# EasyEDA Pro project ProPrj_flex_ir_golf_2025-05-10.epro

# Schematic Schematic1
Board Name: Board1; Create Date: 2024-04-06; Page Name: P1; Project Name: flex_ir_golf; Schematic Name: Schematic1; Update Date: 2025-05-02; Company: EasyEDA.com; Drawn: EasyEDA; Page Size: A4; Part Number: JLCPCB-002; Reviewed: EasyEDA; Version: V0.1
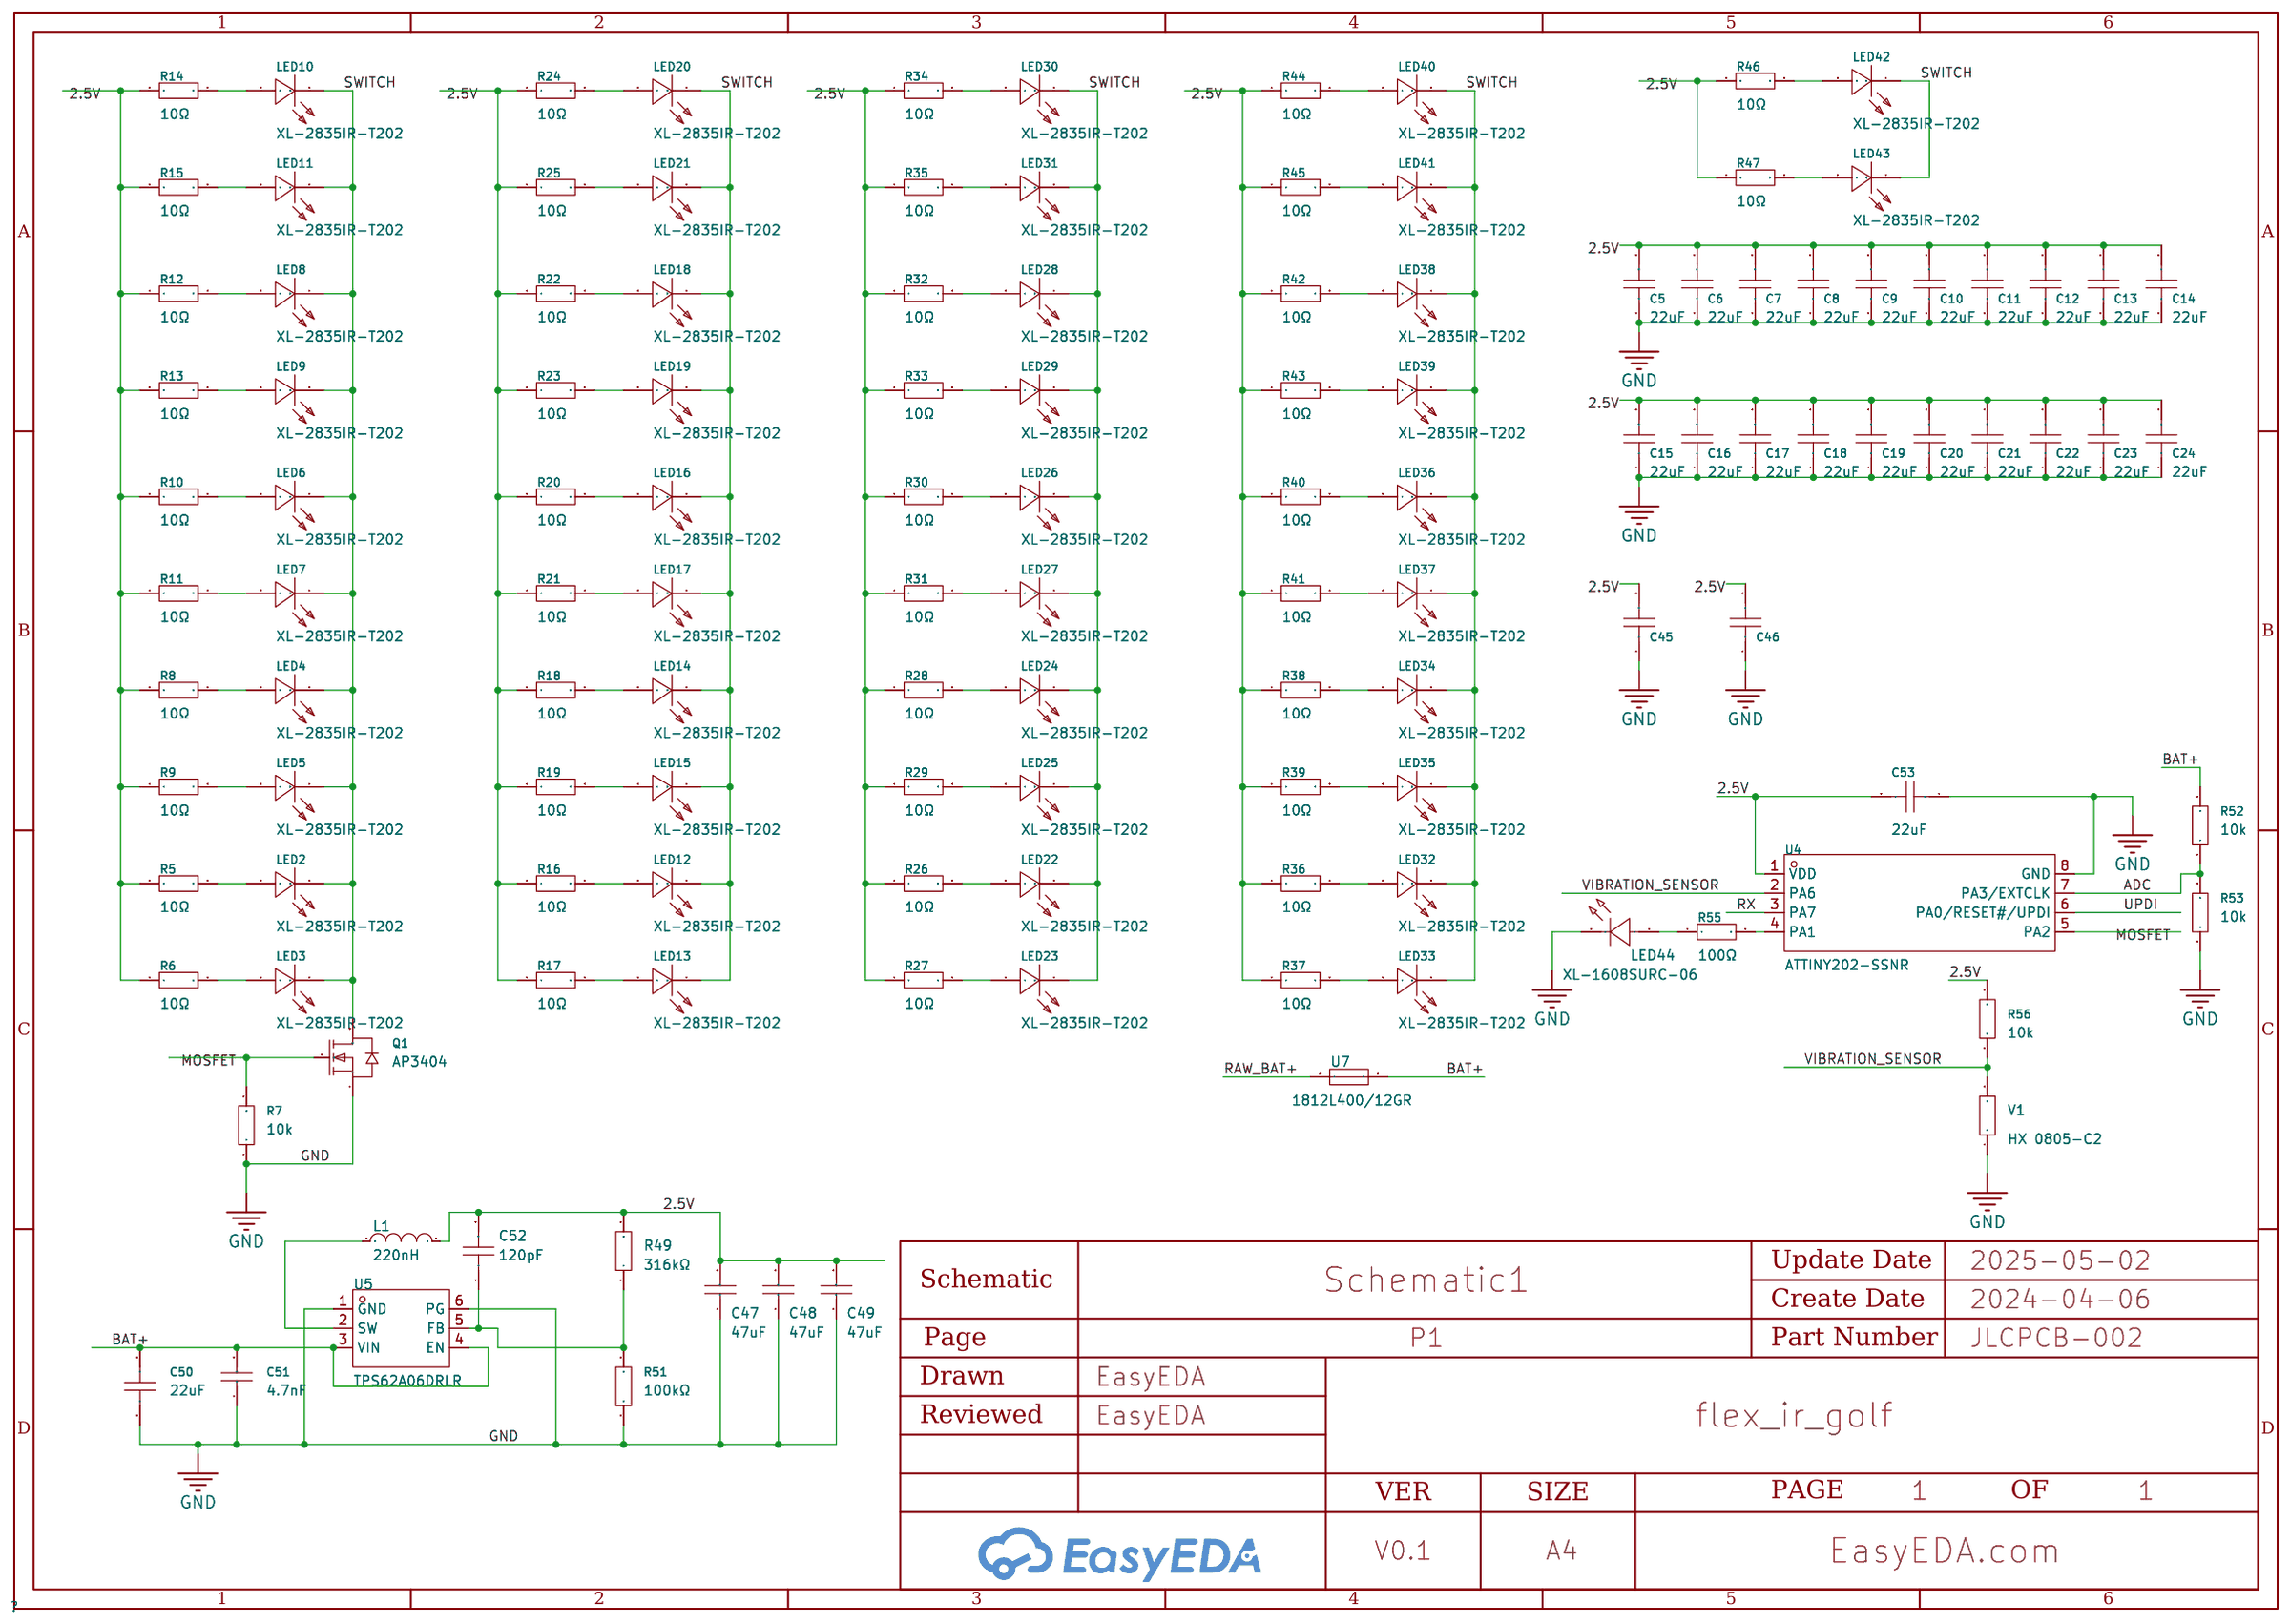
[diagram p0: schematic sheet]

## Parts
C5  22uF  [C0603]
C6  22uF  [C0603]
C7  22uF  [C0603]
C8  22uF  [C0603]
C9  22uF  [C0603]
C10  22uF  [C0603]
C11  22uF  [C0603]
C12  22uF  [C0603]
C13  22uF  [C0603]
C14  22uF  [C0603]
C15  22uF  [C0603]
C16  22uF  [C0603]
C17  22uF  [C0603]
C18  22uF  [C0603]
C19  22uF  [C0603]
C20  22uF  [C0603]
C21  22uF  [C0603]
C22  22uF  [C0603]
C23  22uF  [C0603]
C24  22uF  [C0603]
C45  22uF  [C0603]
C46  22uF  [C0603]
C47  47uF  [C0805]
C48  47uF  [C0805]
C49  47uF  [C0805]
C50  22uF  [C0603]
C51  4.7nF  [C0603]
C52  120pF  [C0603]
C53  22uF  [C0603]
L1  220nH  [IND-SMD_L4.1-W4.1_IHLP1616BZER4R7M11]
LED2  XL-2835IR-T202  [LED-SMD_L128-XX80CB3500001]
LED3  XL-2835IR-T202  [LED-SMD_L128-XX80CB3500001]
LED4  XL-2835IR-T202  [LED-SMD_L128-XX80CB3500001]
LED5  XL-2835IR-T202  [LED-SMD_L128-XX80CB3500001]
LED6  XL-2835IR-T202  [LED-SMD_L128-XX80CB3500001]
LED7  XL-2835IR-T202  [LED-SMD_L128-XX80CB3500001]
LED8  XL-2835IR-T202  [LED-SMD_L128-XX80CB3500001]
LED9  XL-2835IR-T202  [LED-SMD_L128-XX80CB3500001]
LED10  XL-2835IR-T202  [LED-SMD_L128-XX80CB3500001]
LED11  XL-2835IR-T202  [LED-SMD_L128-XX80CB3500001]
LED12  XL-2835IR-T202  [LED-SMD_L128-XX80CB3500001]
LED13  XL-2835IR-T202  [LED-SMD_L128-XX80CB3500001]
LED14  XL-2835IR-T202  [LED-SMD_L128-XX80CB3500001]
LED15  XL-2835IR-T202  [LED-SMD_L128-XX80CB3500001]
LED16  XL-2835IR-T202  [LED-SMD_L128-XX80CB3500001]
LED17  XL-2835IR-T202  [LED-SMD_L128-XX80CB3500001]
LED18  XL-2835IR-T202  [LED-SMD_L128-XX80CB3500001]
LED19  XL-2835IR-T202  [LED-SMD_L128-XX80CB3500001]
LED20  XL-2835IR-T202  [LED-SMD_L128-XX80CB3500001]
LED21  XL-2835IR-T202  [LED-SMD_L128-XX80CB3500001]
LED22  XL-2835IR-T202  [LED-SMD_L128-XX80CB3500001]
LED23  XL-2835IR-T202  [LED-SMD_L128-XX80CB3500001]
LED24  XL-2835IR-T202  [LED-SMD_L128-XX80CB3500001]
LED25  XL-2835IR-T202  [LED-SMD_L128-XX80CB3500001]
LED26  XL-2835IR-T202  [LED-SMD_L128-XX80CB3500001]
LED27  XL-2835IR-T202  [LED-SMD_L128-XX80CB3500001]
LED28  XL-2835IR-T202  [LED-SMD_L128-XX80CB3500001]
LED29  XL-2835IR-T202  [LED-SMD_L128-XX80CB3500001]
LED30  XL-2835IR-T202  [LED-SMD_L128-XX80CB3500001]
LED31  XL-2835IR-T202  [LED-SMD_L128-XX80CB3500001]
LED32  XL-2835IR-T202  [LED-SMD_L128-XX80CB3500001]
LED33  XL-2835IR-T202  [LED-SMD_L128-XX80CB3500001]
LED34  XL-2835IR-T202  [LED-SMD_L128-XX80CB3500001]
LED35  XL-2835IR-T202  [LED-SMD_L128-XX80CB3500001]
LED36  XL-2835IR-T202  [LED-SMD_L128-XX80CB3500001]
LED37  XL-2835IR-T202  [LED-SMD_L128-XX80CB3500001]
LED38  XL-2835IR-T202  [LED-SMD_L128-XX80CB3500001]
LED39  XL-2835IR-T202  [LED-SMD_L128-XX80CB3500001]
LED40  XL-2835IR-T202  [LED-SMD_L128-XX80CB3500001]
LED41  XL-2835IR-T202  [LED-SMD_L128-XX80CB3500001]
LED42  XL-2835IR-T202  [LED-SMD_L128-XX80CB3500001]
LED43  XL-2835IR-T202  [LED-SMD_L128-XX80CB3500001]
LED44  XL-1608SURC-06  [LED0603-RD_RED]
Q1  AP3404  [SOT-23-3_L2.9-W1.3-P1.90-LS2.4-BR-2]
R5  10Ω  [R0603]
R6  10Ω  [R0603]
R7  10k  [R0603]
R8  10Ω  [R0603]
R9  10Ω  [R0603]
R10  10Ω  [R0603]
R11  10Ω  [R0603]
R12  10Ω  [R0603]
R13  10Ω  [R0603]
R14  10Ω  [R0603]
R15  10Ω  [R0603]
R16  10Ω  [R0603]
R17  10Ω  [R0603]
R18  10Ω  [R0603]
R19  10Ω  [R0603]
R20  10Ω  [R0603]
R21  10Ω  [R0603]
R22  10Ω  [R0603]
R23  10Ω  [R0603]
R24  10Ω  [R0603]
R25  10Ω  [R0603]
R26  10Ω  [R0603]
R27  10Ω  [R0603]
R28  10Ω  [R0603]
R29  10Ω  [R0603]
R30  10Ω  [R0603]
R31  10Ω  [R0603]
R32  10Ω  [R0603]
R33  10Ω  [R0603]
R34  10Ω  [R0603]
R35  10Ω  [R0603]
R36  10Ω  [R0603]
R37  10Ω  [R0603]
R38  10Ω  [R0603]
R39  10Ω  [R0603]
R40  10Ω  [R0603]
R41  10Ω  [R0603]
R42  10Ω  [R0603]
R43  10Ω  [R0603]
R44  10Ω  [R0603]
R45  10Ω  [R0603]
R46  10Ω  [R0603]
R47  10Ω  [R0603]
R49  316kΩ  [R0603]
R51  100kΩ  [R0603]
R52  10k  [R0603]
R53  10k  [R0603]
R55  100Ω  [R0603]
R56  10k  [R0603]
U4  ATTINY202-SSNR  [SOIC-8_L5.0-W4.0-P1.27-LS6.0-BL]
U5  TPS62A06DRLR  [SOT-563-6_L1.6-W1.2-P0.50-LS1.6-TL]
U7  1812L400/12GR  [F1812]
V1  HX 0805-C2  [R0805]

## Library data of the parts
C5-C24 C45 C46 C50 C53 = GRM188R60J226MEA0D: Capacitance: Tolerance:±20% Tolerance:±20% Voltage Rated: Temperature Coefficient:; LCSC Part Name: 22uF ±20% 6.3V; Supplier Part: C77042; Manufacturer: muRata(村田); Supplier Footprint: 0603; JLCPCB Part Class: Extended Part; Datasheet: https://atta.szlcsc.com/upload/public/pdf/source/20200305/C490387_23319AE8C154DEB24C505E6C82A8106A.pdf; Supplier: LCSC; Tolerance: ±20%
C47-C49 = C2012X5R1A476MTJ00E: Capacitance: Tolerance:±20% Tolerance:±20% Voltage Rated: Temperature Coefficient:; LCSC Part Name: 47uF ±20% 10V; Supplier Part: C76636; Manufacturer: TDK; Supplier Footprint: 0805; JLCPCB Part Class: Extended Part; Datasheet: https://atta.szlcsc.com/upload/public/pdf/source/20230606/A83975C7E70EF5AFCD4A17254ABD78F2.pdf; Supplier: LCSC; Tolerance: ±20%
C51 = CC0603KRX7R9BB472: Capacitance: Tolerance:±10% Tolerance:±10% Voltage Rated: Temperature Coefficient:; LCSC Part Name: 4.7nF ±10% 50V; Supplier Part: C106218; Manufacturer: YAGEO(国巨); Supplier Footprint: 0603; JLCPCB Part Class: Extended Part; Datasheet: https://atta.szlcsc.com/upload/public/pdf/source/20180910/C282072_33301C7F631E79921B82A8DAC6BCC5B3.pdf; Supplier: LCSC; Tolerance: ±10%
C52 = CL10C121JB8NNNC: Capacitance: Tolerance:±5% Tolerance:±5% Voltage Rated: Temperature Coefficient:; LCSC Part Name: 120pF ±5% 50V; Supplier Part: C18438; Manufacturer: SAMSUNG(三星); Supplier Footprint: 0603; JLCPCB Part Class: Extended Part; Datasheet: https://atta.szlcsc.com/upload/public/pdf/source/20160218/1457707763339.pdf; Supplier: LCSC; Tolerance: ±5%
L1 = IHLP1616BZERR22M01: Inductance: Tolerance:±20% Tolerance:±20% Rated Current: Saturation Current (Isat):24A DC Resistance (DCR): Ratings:-; LCSC Part Name: 220nH ±20% 24A; Supplier Part: C844981; Manufacturer: VISHAY(威世); Supplier Footprint: 1616; JLCPCB Part Class: Extended Part; Datasheet: https://atta.szlcsc.com/upload/public/pdf/source/20231218/7C3D4DFF03E0D8B7F5A3F136F971DD90.pdf; Supplier: LCSC; Tolerance: ±20%; Saturation Current (Isat): 24A
LED2-LED43 = L128-4080CB3500001_C358168: Emitted Color:White; LCSC Part Name: 白灯; Supplier Part: C5221243; Manufacturer: Lumileds(亮锐); Supplier Footprint: SMD2835; JLCPCB Part Class: Extended Part; Datasheet: https://atta.szlcsc.com/upload/public/pdf/source/20190124/C358170_8734630ADD1BE4D019D2695C6D605BA1.pdf; Supplier: LCSC; Emitted Color: IR
LED44 = XL-1608SURC-06: Emitted Color:Red Power Dissipation:55mW Forward Current:25mA Dominant Wavelength:617nm~621nm Dominant Wavelength:617nm~621nm Peak Wavelength:623nm Lens Color:无色透明透镜 Color Temperature:- Color Temperature:- Viewing Angle:120° Mounting Sytle:Positive post O; Supplier Part: C965799; Manufacturer: XINGLIGHT(成兴光); Supplier Footprint: 0603; JLCPCB Part Class: Extended Part; Datasheet: https://atta.szlcsc.com/upload/public/pdf/source/20221102/D860AFDD1CDB02C5A8064103A32707E2.pdf; Supplier: LCSC; Emitted Color: Red; Power Dissipation: 55mW; Forward Current: 25mA; Dominant Wavelength: 617nm~621nm; Peak Wavelength: 623nm; Lens Color: 无色透明透镜; Viewing Angle: 120°; Mounting Sytle: Positive post; Operating Temperature: -30℃~+85℃
Q1 = AP3404: Type: Drain Source Voltage (Vdss): Continuous Drain Current (Id): Power Dissipation (Pd): Drain Source On Resistance (RDS(on)@Vgs,Id):18mΩ@10V,5.8A Gate Threshold Voltage (Vgs(th)@Id):1.6V@250uA Total Gate Charge (Qg@Vgs):- Input Capacitance (Ciss@Vds):34; LCSC Part Name: N沟道 耐压:30V 电流:5.8A; Supplier Part: C2842665; Manufacturer: ALLPOWER(铨力); Supplier Footprint: SOT-23; JLCPCB Part Class: Extended Part; Datasheet: https://atta.szlcsc.com/upload/public/pdf/source/20210629/C2842665_6746D340194B1D8C1AEB6994A54BD307.pdf; Supplier: LCSC; Drain Source On Resistance (RDS(on)@Vgs,Id): 18mΩ@10V,5.8A; Gate Threshold Voltage (Vgs(th)@Id): 1.6V@250uA; Input Capacitance (Ciss@Vds): 345pF@15V; Reverse Transfer Capacitance (Crss@Vds): 32pF@15V; Operating Temperature: -55℃~+150℃@(Tj)
R5-R47 R52 R53 R56 = 0603WAF100JT5E: Type:Thick Film Resistors Resistance:10Ω Tolerance:±1% Tolerance:±1% Power(Watts): Overload Voltage (Max): Temperature Coefficient:±400ppm/℃ Temperature Coefficient:±400ppm/℃ Operating Temperature Range:-55℃~+155℃ Operating Temperature Range:-55℃~+155℃; LCSC Part Name: 10Ω ±1% 100mW 厚膜电阻; Supplier Part: C22859; Manufacturer: UNI-ROYAL(厚声); Supplier Footprint: 0603; JLCPCB Part Class: Basic Part; Datasheet: https://atta.szlcsc.com/upload/public/pdf/source/20200306/C422600_1E6D84923E4A46A82E41ADD87F860B5C.pdf; Supplier: LCSC; Type: Thick Film Resistors; Tolerance: ±1%; Temperature Coefficient: ±400ppm/℃; Operating Temperature Range: -55℃~+155℃
R49 = RC0603FR-07316KL: Type:Thick Film Resistors Resistance: Tolerance:±1% Tolerance:±1% Power(Watts): Overload Voltage (Max): Temperature Coefficient:±100ppm/℃ Temperature Coefficient:±100ppm/℃ Operating Temperature Range:-55℃~+155℃ Operating Temperature Range:-55℃~+155℃; LCSC Part Name: 厚膜电阻 316kΩ ±1% 100mW; Supplier Part: C185340; Manufacturer: YAGEO(国巨); Supplier Footprint: 0603; JLCPCB Part Class: Extended Part; Datasheet: https://atta.szlcsc.com/upload/public/pdf/source/20180904/C276339_014E484F1DBA106FB92D45EABD5A1AC1.pdf; Supplier: LCSC; Type: Thick Film Resistors; Tolerance: ±1%; Temperature Coefficient: ±100ppm/℃; Operating Temperature Range: -55℃~+155℃
R51 = RC0603FR-07100KL: Type:Thick Film Resistors Resistance: Tolerance:±1% Tolerance:±1% Power(Watts): Overload Voltage (Max): Temperature Coefficient:±100ppm/℃ Temperature Coefficient:±100ppm/℃ Operating Temperature Range:-55℃~+155℃ Operating Temperature Range:-55℃~+155℃; LCSC Part Name: 厚膜电阻 100kΩ ±1% 100mW; Supplier Part: C14675; Manufacturer: YAGEO(国巨); Supplier Footprint: 0603; JLCPCB Part Class: Extended Part; Datasheet: https://atta.szlcsc.com/upload/public/pdf/source/20140324/1457707028752.pdf; Supplier: LCSC; Type: Thick Film Resistors; Tolerance: ±1%; Temperature Coefficient: ±100ppm/℃; Operating Temperature Range: -55℃~+155℃
R55 = 0603WAJ0101T5E: Type:Thick Film Resistors Resistance: Tolerance:±5% Tolerance:±5% Power(Watts): Overload Voltage (Max): Temperature Coefficient:±100ppm/℃ Temperature Coefficient:±100ppm/℃ Operating Temperature Range:-55℃~+155℃ Operating Temperature Range:-55℃~+155℃; LCSC Part Name: 100Ω ±5% 100mW 厚膜电阻; Supplier Part: C25201; Manufacturer: UNI-ROYAL(厚声); Supplier Footprint: 0603; JLCPCB Part Class: Extended Part; Datasheet: https://atta.szlcsc.com/upload/public/pdf/source/20200306/C422600_1E6D84923E4A46A82E41ADD87F860B5C.pdf; Supplier: LCSC; Type: Thick Film Resistors; Tolerance: ±5%; Temperature Coefficient: ±100ppm/℃; Operating Temperature Range: -55℃~+155℃
U4 = ATTINY202-SSNR: CPU Core:AVR Program Storage Size:2KB RAM Size:128Byte GPIO Ports Number:6 Operating Voltage Range:1.8V~5.5V Operating Voltage Range:1.8V~5.5V CPU Maximum Speed:20MHz Program Memory Type:FLASH Operating Temperature Range:-40℃~+105℃ Operating Temperature R; Supplier Part: C2052951; Manufacturer: MICROCHIP(美国微芯); Supplier Footprint: SOIC-8; JLCPCB Part Class: Extended Part; Datasheet: https://atta.szlcsc.com/upload/public/pdf/source/20210630/C2052951_DF1F867FA15E2F0F74210386DED84B7F.pdf; Supplier: LCSC; CPU Core: AVR; Program Storage Size: 2KB; RAM Size: 128Byte; GPIO Ports Number: 6; Operating Voltage Range: 1.8V~5.5V; CPU Maximum Speed: 20MHz; Program Memory Type: FLASH; Operating Temperature Range: -40℃~+105℃; ADC (Bit): 10bit; Peripheral/Function: WDT；LIN总线协议；IrDA; Watchdog: 有; Infrared Data Association: 有; Low-Voltage Detect: 有; Internal Oscillator: 有
U5 = TPS62A06DRLR: Supplier Part: C22365365; Manufacturer: TI(德州仪器); Supplier Footprint: SOT-5X3-6; JLCPCB Part Class: Extended Part; Datasheet: https://atta.szlcsc.com/upload/public/pdf/source/20240321/41946EFE8F53C92CA8741079F1A5949F.pdf; Supplier: LCSC
U7 = 1812L400/12GR: Operating Voltage (Max):12V Current Rating (Max):40A Hold Current:4A Trip Current:7A Power Dissipation:2W Resistance - Initial (Ri) (Min):5mΩ Resistance - Post Trip (R1) (Max):25mΩ Maximum Time to Trip:4ms Operating Temperature:-40℃~+85℃ Operating Tempera; LCSC Part Name: 12V 4A 1812自恢复; Supplier Part: C7542976; Manufacturer: LUTE(陆特); Supplier Footprint: 1812; JLCPCB Part Class: Extended Part; Datasheet: https://atta.szlcsc.com/upload/public/pdf/source/20230824/A44D5C29BF5EAF37C9B8C94242010A73.pdf; Supplier: LCSC; Operating Voltage (Max): 12V; Current Rating (Max): 40A; Hold Current: 4A; Trip Current: 7A; Power Dissipation: 2W; Resistance - Initial (Ri) (Min): 5mΩ; Resistance - Post Trip (R1) (Max): 25mΩ; Maximum Time to Trip: 4ms; Operating Temperature: -40℃~+85℃
V1 = RS-05K1000FT: Tolerance: Temperature Coefficient: Temperature Coefficient: Resistance: Power(Watts): Overload Voltage (Max): Operating Temperature Range: Operating Temperature Range:; LCSC Part Name: 100Ω(1000) ±1%; Supplier Part: C115424; Manufacturer: hanxia; Supplier Footprint: 0805; JLCPCB Part Class: Extended Part; Datasheet: https://atta.szlcsc.com/upload/public/pdf/source/20170704/1499151318885.pdf; Supplier: LCSC

## Nets
2.5V: C5.2 C6.2 C7.2 C8.2 C9.2 C10.2 C11.2 C12.2 C13.2 C14.2 C15.2 C16.2 C17.2 C18.2 C19.2 C20.2 C21.2 C22.2 C23.2 C24.2 C45.2 C46.2 C47.2 C48.2 C49.2 C52.2 C53.2 L1.2 R5.1 R6.1 R8.1 R9.1 R10.1 R11.1 R12.1 R13.1 R14.1 R15.1 R16.1 R17.1 R18.1 R19.1 R20.1 R21.1 R22.1 R23.1 R24.1 R25.1 R26.1 R27.1 R28.1 R29.1 R30.1 R31.1 R32.1 R33.1 R34.1 R35.1 R36.1 R37.1 R38.1 R39.1 R40.1 R41.1 R42.1 R43.1 R44.1 R45.1 R46.1 R47.1 R49.2 R56.1 U4.1(VDD)
GND: C5.1 C6.1 C7.1 C8.1 C9.1 C10.1 C11.1 C12.1 C13.1 C14.1 C15.1 C16.1 C17.1 C18.1 C19.1 C20.1 C21.1 C22.1 C23.1 C24.1 C45.1 C46.1 C47.1 C48.1 C49.1 C50.1 C51.1 C53.1 LED44.1(K) Q1.1(S) R7.1 R51.1 R53.1 U4.8(GND) U5.1(GND) U5.6(PG) V1.1
ADC: R52.1 R53.2 U4.7(PA3/EXTCLK)
BAT+: C50.2 C51.2 R52.2 U5.3(VIN) U5.4(EN) U7.2
MOSFET: Q1.2(G) R7.2 U4.5(PA2)
RAW_BAT+: U7.1
RX: U4.3(PA7)
SWITCH: LED2.1(C) LED3.1(C) LED4.1(C) LED5.1(C) LED6.1(C) LED7.1(C) LED8.1(C) LED9.1(C) LED10.1(C) LED11.1(C) LED12.1(C) LED13.1(C) LED14.1(C) LED15.1(C) LED16.1(C) LED17.1(C) LED18.1(C) LED19.1(C) LED20.1(C) LED21.1(C) LED22.1(C) LED23.1(C) LED24.1(C) LED25.1(C) LED26.1(C) LED27.1(C) LED28.1(C) LED29.1(C) LED30.1(C) LED31.1(C) LED32.1(C) LED33.1(C) LED34.1(C) LED35.1(C) LED36.1(C) LED37.1(C) LED38.1(C) LED39.1(C) LED40.1(C) LED41.1(C) LED42.1(C) LED43.1(C) Q1.3(D)
UPDI: U4.6(PA0/RESET#/UPDI)
VIBRATION_SENSOR: R56.2 U4.2(PA6) V1.2
$1N2397: LED2.2(A) R5.2
$1N2467: LED3.2(A) R6.2
$1N2959: LED4.2(A) R8.2
$1N2961: LED5.2(A) R9.2
$1N3108: LED6.2(A) R10.2
$1N3110: LED7.2(A) R11.2
$1N3257: LED8.2(A) R12.2
$1N3259: LED9.2(A) R13.2
$1N3406: LED10.2(A) R14.2
$1N3408: LED11.2(A) R15.2
$1N4472: LED12.2(A) R16.2
$1N4474: LED13.2(A) R17.2
$1N4476: LED14.2(A) R18.2
$1N4478: LED15.2(A) R19.2
$1N4480: LED16.2(A) R20.2
$1N4482: LED17.2(A) R21.2
$1N4484: LED18.2(A) R22.2
$1N4486: LED19.2(A) R23.2
$1N4488: LED20.2(A) R24.2
$1N4490: LED21.2(A) R25.2
$1N5215: LED22.2(A) R26.2
$1N5217: LED23.2(A) R27.2
$1N5219: LED24.2(A) R28.2
$1N5221: LED25.2(A) R29.2
$1N5223: LED26.2(A) R30.2
$1N5225: LED27.2(A) R31.2
$1N5227: LED28.2(A) R32.2
$1N5229: LED29.2(A) R33.2
$1N5231: LED30.2(A) R34.2
$1N5233: LED31.2(A) R35.2
$1N5958: LED32.2(A) R36.2
$1N5960: LED33.2(A) R37.2
$1N5962: LED34.2(A) R38.2
$1N5964: LED35.2(A) R39.2
$1N5966: LED36.2(A) R40.2
$1N5968: LED37.2(A) R41.2
$1N5970: LED38.2(A) R42.2
$1N5972: LED39.2(A) R43.2
$1N5974: LED40.2(A) R44.2
$1N5976: LED41.2(A) R45.2
$1N6160: LED42.2(A) R46.2
$1N6162: LED43.2(A) R47.2
$1N26713: L1.1 U5.2(SW)
$1N26861: C52.1 R49.1 R51.2 U5.5(FB)
$1N27838: LED44.2(A) R55.1
$1N27880: R55.2 U4.4(PA1)

# Board PCB1
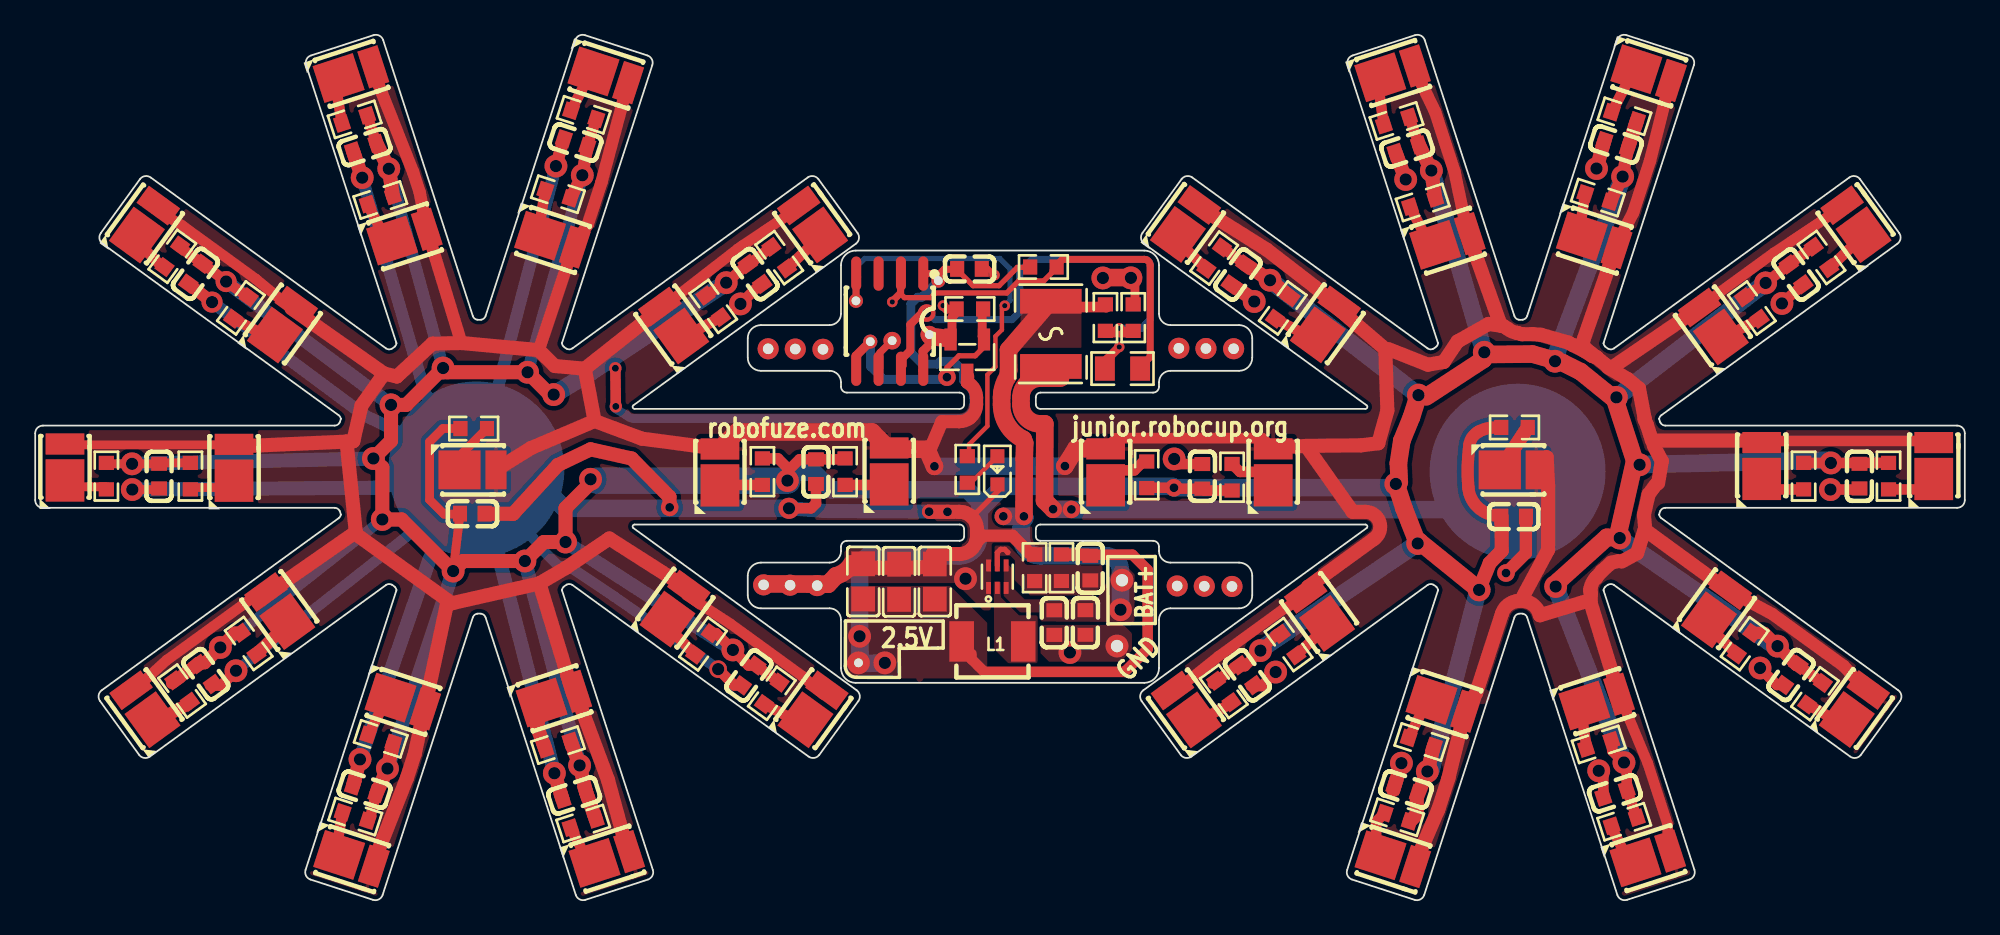
[diagram p1: board, top side]
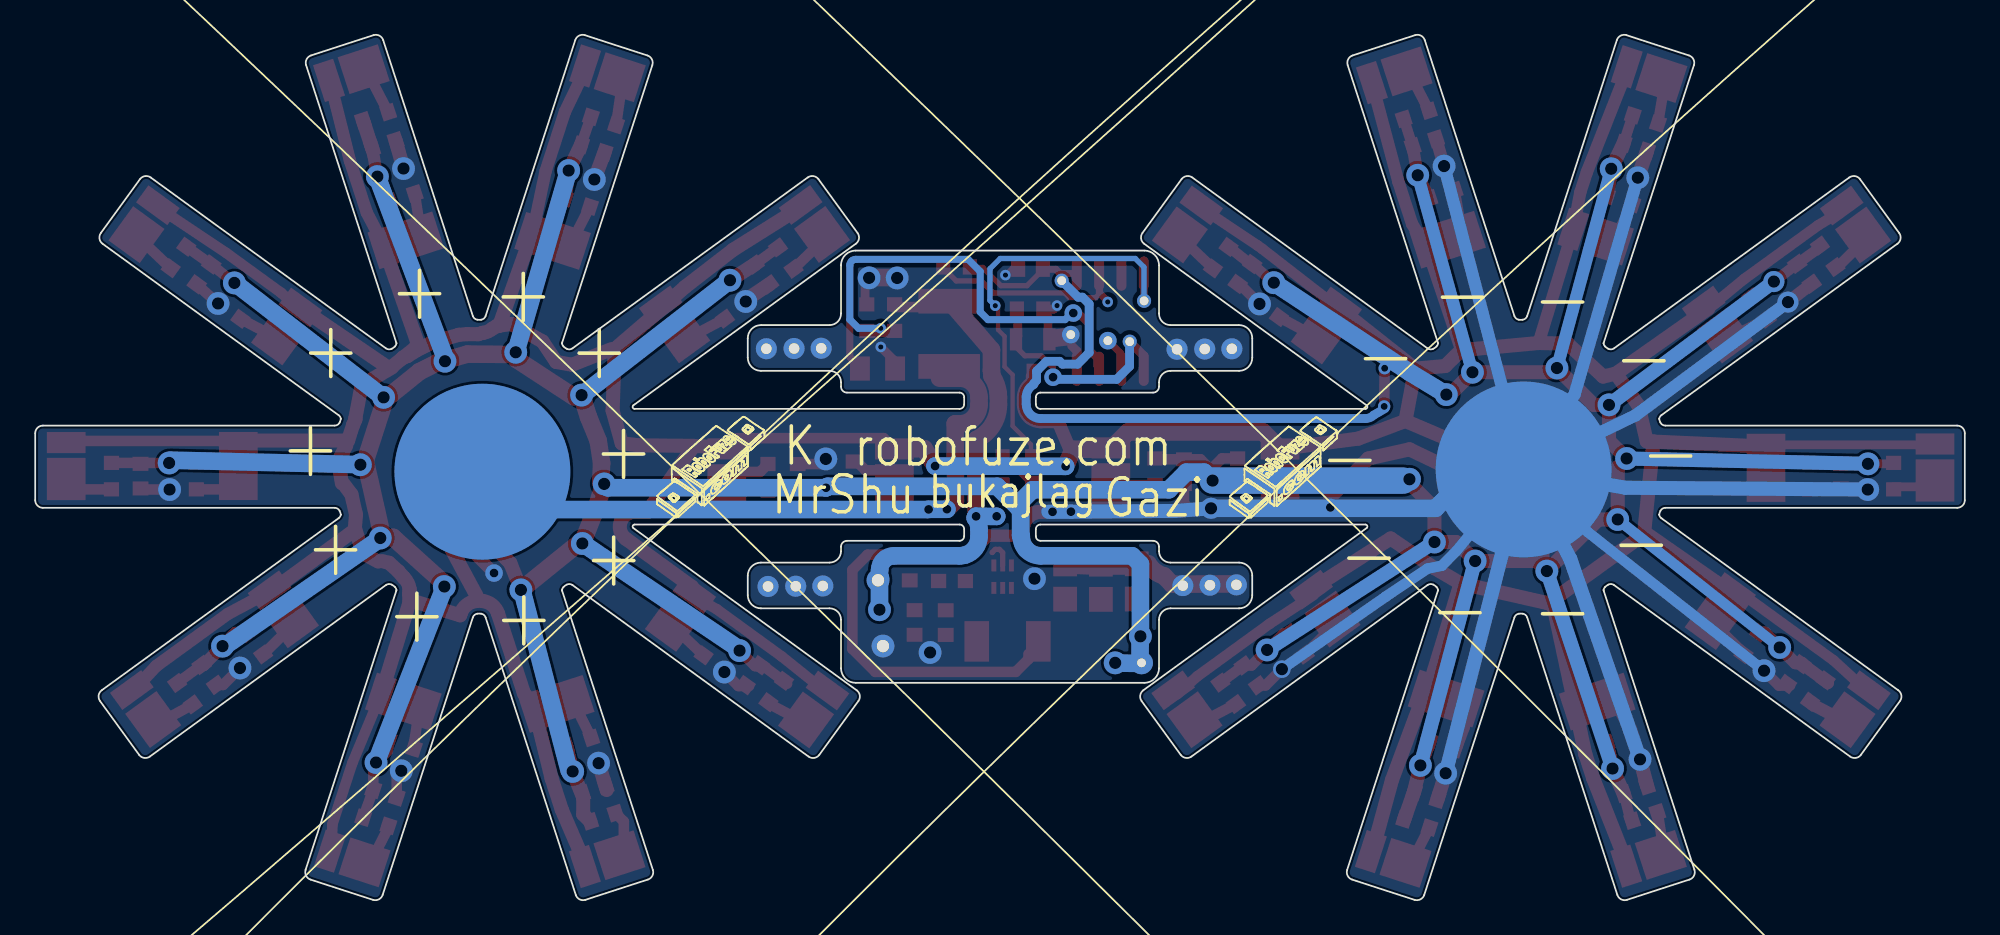
[diagram p2: board, bottom side, seen from below]

Outline 109.68 x 49.16 mm; copper layers: Top Layer, Bottom Layer. Coordinates in mm from the lower left corner of the outline.
Stack: Top Layer 0.012mm / Dielectric1 0.025mm FR4 er 4.5 / Bottom Layer 0.012mm

## Design rules (mm)
template: Custom Config
spacing copperThickness1oz (default): track to track 0.102, other pairs 0.152 to 0.3
spacing copperThickness2oz: track to track 0.203, other pairs 0.152 to 0.3
track width copperThickness1oz (default): min 0.127, default 0.254, max 2.54
track width copperThickness2oz: min 0.203, default 0.254, max 2.54
differential pair differentialPair (default): width min 0.127, default 0.254, max 2.54; gap min 0.152, default 0.152
via viaSize (default): diameter min 0.5, default 0.61, max 10; hole min 0.3, default 0.305, max 6.3
net GND uses copperFULL
net 2.5V uses copperFULL
net $1N26713 uses copperFULL
net BAT+ uses copperFULL
net $1N26861 uses copperFULL
net RAW_BAT+ uses copperFULL

## Placement (name value [footprint] x y rotation side)
C5  22uF  [C0603]  44.38 24.34 90 top
C6  22uF  [C0603]  7.04 24.09 90 top
C7  22uF  [C0603]  89.86 42.95 342 top
C8  22uF  [C0603]  89.8 6.05 18 top
C9  22uF  [C0603]  77.99 42.71 18 top
C10  22uF  [C0603]  30.64 5.93 18 top
C11  22uF  [C0603]  18.73 42.79 18 top
C12  22uF  [C0603]  103.69 24.09 90 top
C13  22uF  [C0603]  66.34 24.07 270 top
C14  22uF  [C0603]  99.8 12.78 54 top
C15  22uF  [C0603]  18.73 6.26 342 top
C16  22uF  [C0603]  30.72 43.05 342 top
C17  22uF  [C0603]  77.92 6.27 342 top
C18  22uF  [C0603]  9.7 12.84 126 top
C19  22uF  [C0603]  40.91 35.58 126 top
C20  22uF  [C0603]  68.89 12.77 126 top
C21  22uF  [C0603]  100.08 35.56 126 top
C22  22uF  [C0603]  40.57 12.76 54 top
C23  22uF  [C0603]  68.37 35.56 54 top
C24  22uF  [C0603]  24.85 21.95 180 top
C45  22uF  [C0603]  9.11 35.59 54 top
C46  22uF  [C0603]  84.03 21.79 180 top
C47  47uF  [C0805]  51.13 18.09 270 top
C48  47uF  [C0805]  49.1 18.08 270 top
C49  47uF  [C0805]  47.06 18.1 270 top
C50  22uF  [C0603]  59.69 15.77 90 top
C51  4.7nF  [C0603]  57.92 15.76 90 top
C52  120pF  [C0603]  59.97 18.86 90 top
C53  22uF  [C0603]  53.1 35.87 180 top
L1  220nH  [IND-SMD_L4.1-W4.1_IHLP1616BZER4R7M11]  54.41 14.69 180 top
LED2  XL-2835IR-T202  [LED-SMD_L128-XX80CB3500001]  6.39 38.63 234 top
LED3  XL-2835IR-T202  [LED-SMD_L128-XX80CB3500001]  14.23 32.95 234 top
LED4  XL-2835IR-T202  [LED-SMD_L128-XX80CB3500001]  11.3 24.86 270 top
LED5  XL-2835IR-T202  [LED-SMD_L128-XX80CB3500001]  1.69 24.88 270 top
LED6  XL-2835IR-T202  [LED-SMD_L128-XX80CB3500001]  48.54 24.66 270 top
LED7  XL-2835IR-T202  [LED-SMD_L128-XX80CB3500001]  38.92 24.6 270 top
LED8  XL-2835IR-T202  [LED-SMD_L128-XX80CB3500001]  70.37 24.6 270 top
LED9  XL-2835IR-T202  [LED-SMD_L128-XX80CB3500001]  60.84 24.6 270 top
LED10  XL-2835IR-T202  [LED-SMD_L128-XX80CB3500001]  107.91 24.96 270 top
LED11  XL-2835IR-T202  [LED-SMD_L128-XX80CB3500001]  98.13 24.96 270 top
LED12  XL-2835IR-T202  [LED-SMD_L128-XX80CB3500001]  36.54 16.8 234 top
LED13  XL-2835IR-T202  [LED-SMD_L128-XX80CB3500001]  44.39 11.07 234 top
LED14  XL-2835IR-T202  [LED-SMD_L128-XX80CB3500001]  80.55 37.56 198 top
LED15  XL-2835IR-T202  [LED-SMD_L128-XX80CB3500001]  77.44 47.09 198 top
LED16  XL-2835IR-T202  [LED-SMD_L128-XX80CB3500001]  91.94 2.45 198 top
LED17  XL-2835IR-T202  [LED-SMD_L128-XX80CB3500001]  89.04 11.37 198 top
LED18  XL-2835IR-T202  [LED-SMD_L128-XX80CB3500001]  21.27 37.8 198 top
LED19  XL-2835IR-T202  [LED-SMD_L128-XX80CB3500001]  18.23 47.04 198 top
LED20  XL-2835IR-T202  [LED-SMD_L128-XX80CB3500001]  32.78 2.42 198 top
LED21  XL-2835IR-T202  [LED-SMD_L128-XX80CB3500001]  29.77 11.54 198 top
LED22  XL-2835IR-T202  [LED-SMD_L128-XX80CB3500001]  73.51 32.96 234 top
LED23  XL-2835IR-T202  [LED-SMD_L128-XX80CB3500001]  65.56 38.67 234 top
LED24  XL-2835IR-T202  [LED-SMD_L128-XX80CB3500001]  21.18 11.18 162 top
LED25  XL-2835IR-T202  [LED-SMD_L128-XX80CB3500001]  18.26 2.23 162 top
LED26  XL-2835IR-T202  [LED-SMD_L128-XX80CB3500001]  32.72 46.78 162 top
LED27  XL-2835IR-T202  [LED-SMD_L128-XX80CB3500001]  29.68 37.43 162 top
LED28  XL-2835IR-T202  [LED-SMD_L128-XX80CB3500001]  80.35 11.04 162 top
LED29  XL-2835IR-T202  [LED-SMD_L128-XX80CB3500001]  77.45 2.21 162 top
LED30  XL-2835IR-T202  [LED-SMD_L128-XX80CB3500001]  91.99 46.9 162 top
LED31  XL-2835IR-T202  [LED-SMD_L128-XX80CB3500001]  88.9 37.4 162 top
LED32  XL-2835IR-T202  [LED-SMD_L128-XX80CB3500001]  95.75 16.76 234 top
LED33  XL-2835IR-T202  [LED-SMD_L128-XX80CB3500001]  103.58 11.09 234 top
LED34  XL-2835IR-T202  [LED-SMD_L128-XX80CB3500001]  36.11 32.9 306 top
LED35  XL-2835IR-T202  [LED-SMD_L128-XX80CB3500001]  44.01 38.64 306 top
LED36  XL-2835IR-T202  [LED-SMD_L128-XX80CB3500001]  6.06 11.08 306 top
LED37  XL-2835IR-T202  [LED-SMD_L128-XX80CB3500001]  13.72 16.66 306 top
LED38  XL-2835IR-T202  [LED-SMD_L128-XX80CB3500001]  72.82 16.55 306 top
LED39  XL-2835IR-T202  [LED-SMD_L128-XX80CB3500001]  65.25 11.06 306 top
LED40  XL-2835IR-T202  [LED-SMD_L128-XX80CB3500001]  95.2 32.84 306 top
LED41  XL-2835IR-T202  [LED-SMD_L128-XX80CB3500001]  103.31 38.65 306 top
LED42  XL-2835IR-T202  [LED-SMD_L128-XX80CB3500001]  25.15 24.44 180 top
LED43  XL-2835IR-T202  [LED-SMD_L128-XX80CB3500001]  84.28 24.44 180 top
LED44  XL-1608SURC-06  [LED0603-RD_RED]  54.69 24.42 90 top
NOREF  -  [Pad_e3191]  48.71 31.79 0 top
NOREF#2  -  [Pad_e3229]  46.65 34.06 0 top
NOREF#3  -  [Pad_e513]  42.91 17.89 0 top
NOREF#4  -  [Pad_e15]  51.33 35.2 0 top
NOREF#5  -  [Pad_e510]  64.91 17.84 0 top
NOREF#6  -  [Pad_e14]  65 31.36 0 top
NOREF#7  -  [Pad_e50]  41.4 17.91 0 top
NOREF#8  -  [Pad_e597]  84.26 24.34 180 top
NOREF#9  -  [Pad_e507]  41.66 31.33 0 top
NOREF#10  -  [Pad_e506]  43.2 31.31 0 top
NOREF#11  -  [Pad_e2494]  46.79 13.47 0 top
NOREF#12  -  [Pad_e509]  66.45 17.83 0 top
NOREF#13  -  [Pad_e3190]  47.47 31.73 0 top
NOREF#14  -  [Pad_e508]  68.02 17.82 0 top
NOREF#15  -  [Pad_e13]  66.54 31.34 0 top
NOREF#16  -  [Pad_e4190]  50.82 32.13 0 top
NOREF#17  -  [Pad_e502]  44.78 31.3 0 top
NOREF#18  -  [Pad_e2448]  61.77 18.17 0 top
NOREF#19  -  [Pad_e514]  44.45 17.86 0 top
NOREF#20  -  [Pad_e599]  25.08 24.47 180 top
NOREF#21  -  [Pad_e52]  68.12 31.33 0 top
NOREF#22  -  [Pad_e2493]  61.49 14.43 0 top
Q1  AP3404  [SOT-23-3_L2.9-W1.3-P1.90-LS2.4-BR-2]  52.98 30.86 180 top
R5  10Ω  [R0603]  7.79 36.58 234 top
R6  10Ω  [R0603]  11.69 33.65 234 top
R7  10k  [R0603]  53.13 33.59 0 top
R8  10Ω  [R0603]  8.82 24.09 270 top
R9  10Ω  [R0603]  4.05 24.09 270 top
R10  10Ω  [R0603]  46.03 24.34 270 top
R11  10Ω  [R0603]  41.33 24.34 270 top
R12  10Ω  [R0603]  68.03 24.02 90 top
R13  10Ω  [R0603]  63.18 24.16 90 top
R14  10Ω  [R0603]  105.34 24.09 270 top
R15  10Ω  [R0603]  100.52 24.09 270 top
R16  10Ω  [R0603]  37.96 14.55 234 top
R17  10Ω  [R0603]  41.87 11.74 234 top
R18  10Ω  [R0603]  78.86 39.65 198 top
R19  10Ω  [R0603]  77.38 44.28 198 top
R20  10Ω  [R0603]  90.32 4.44 198 top
R21  10Ω  [R0603]  88.87 8.83 198 top
R22  10Ω  [R0603]  19.62 39.78 198 top
R23  10Ω  [R0603]  18.16 44.37 198 top
R24  10Ω  [R0603]  31.15 4.34 198 top
R25  10Ω  [R0603]  29.71 8.8 198 top
R26  10Ω  [R0603]  70.91 33.65 234 top
R27  10Ω  [R0603]  67.01 36.48 234 top
R28  10Ω  [R0603]  19.64 9.15 162 top
R29  10Ω  [R0603]  18.19 4.73 162 top
R30  10Ω  [R0603]  31.18 44.63 162 top
R31  10Ω  [R0603]  29.71 40.12 162 top
R32  10Ω  [R0603]  78.79 8.97 162 top
R33  10Ω  [R0603]  77.41 4.69 162 top
R34  10Ω  [R0603]  90.33 44.55 162 top
R35  10Ω  [R0603]  88.82 39.93 162 top
R36  10Ω  [R0603]  97.16 14.56 234 top
R37  10Ω  [R0603]  101.16 11.72 234 top
R38  10Ω  [R0603]  38.54 33.74 306 top
R39  10Ω  [R0603]  42.29 36.51 306 top
R40  10Ω  [R0603]  8.35 11.87 306 top
R41  10Ω  [R0603]  12.14 14.58 306 top
R42  10Ω  [R0603]  71.24 14.51 306 top
R43  10Ω  [R0603]  67.56 11.84 306 top
R44  10Ω  [R0603]  97.57 33.64 306 top
R45  10Ω  [R0603]  101.53 36.52 306 top
R46  10Ω  [R0603]  24.92 26.79 0 top
R47  10Ω  [R0603]  84.08 26.86 0 top
R49  316kΩ  [R0603]  58.33 18.88 90 top
R51  100kΩ  [R0603]  56.81 18.88 270 top
R52  10k  [R0603]  60.83 33.1 90 top
R53  10k  [R0603]  62.41 33.1 270 top
R55  100Ω  [R0603]  52.98 24.47 90 top
R56  10k  [R0603]  57.31 35.98 0 top
U4  ATTINY202-SSNR  [SOIC-8_L5.0-W4.0-P1.27-LS6.0-BL]  48.57 32.9 180 top
U5  TPS62A06DRLR  [SOT-563-6_L1.6-W1.2-P0.50-LS1.6-TL]  54.69 18.37 90 top
U7  1812L400/12GR  [F1812]  57.73 32.18 90 top
V1  HX 0805-C2  [R0805]  61.8 30.2 0 top

## Footprints (pads in the part's own frame, mm; a bottom-side part is the same pattern mirrored in y, then rotated)
C0603
  rect 0.8x0.9 smd: 1(-0.7,0) 2(0.7,0)
C0805
  rect 1.41x1.35 smd: 1(-1,0) 2(1,0)
F1812
  rect 1.407x3.499 smd: 1(-1.853,0) 2(1.853,0)
IND-SMD_L4.1-W4.1_IHLP1616BZER4R7M11
  rect 1.4x2.3 smd: 1(-1.75,0) 2(1.75,0)
LED0603-RD_RED
  rect 0.8x0.8 smd: 1(-0.799,-0.004) 2(0.799,0.004)
LED-SMD_L128-XX80CB3500001
  rect 1.2x2.2 smd: 1(-1.035,0)
  rect 2.4x2.2 smd: 2(1.035,0)
Pad_e13
  round 1.2 hole 0.6: 1(0,0)
Pad_e14
  round 1.2 hole 0.6: 1(0,0)
Pad_e15
  round 0.8 hole 0.5: 1(0,0)
Pad_e50
  round 1.2 hole 0.6: 1(0,0)
Pad_e52
  round 1.2 hole 0.6: 1(0,0)
Pad_e502
  round 1.2 hole 0.6: 1(0,0)
Pad_e506
  round 1.2 hole 0.6: 1(0,0)
Pad_e507
  round 1.2 hole 0.6: 1(0,0)
Pad_e508
  round 1.2 hole 0.6: 1(0,0)
Pad_e509
  round 1.2 hole 0.6: 1(0,0)
Pad_e510
  round 1.2 hole 0.6: 1(0,0)
Pad_e513
  round 1.2 hole 0.6: 1(0,0)
Pad_e514
  round 1.2 hole 0.6: 1(0,0)
Pad_e597
  round 10 smd far side: 5(0,0)
Pad_e599
  round 10 smd far side: 5(0,0)
Pad_e2448
  round 1.3 hole 0.7: 1(0,0)
Pad_e2493
  round 1.3 hole 0.7: 1(0,0)
Pad_e2494
  round 1.3 hole 0.5: 1(0,0)
Pad_e3190
  round 0.8 hole 0.5: 1(0,0)
Pad_e3191
  round 1 hole 0.5: 1(0,0)
Pad_e3229
  round 0.8 hole 0.5: 1(0,0)
Pad_e4190
  round 1 hole 0.5: 1(0,0)
R0603
  rect 0.806x0.864 smd: 1(-0.753,0) 2(0.753,0)
R0805
  rect 1.133x1.377 smd: 1(-1,0) 2(1,0)
SOIC-8_L5.0-W4.0-P1.27-LS6.0-BL
  oval 0.569x1.95 smd: 1(-1.905,-2.705) 2(-0.635,-2.705) 3(0.635,-2.705) 4(1.905,-2.705) 5(1.905,2.705) 6(0.635,2.705) 7(-0.635,2.705) 8(-1.905,2.705)
SOT-23-3_L2.9-W1.3-P1.90-LS2.4-BR-2
  rect 0.7x1.25 smd: 1(0.95,-1) 2(-0.95,-1) 3(0,1)
SOT-563-6_L1.6-W1.2-P0.50-LS1.6-TL
  rect 0.68x0.28 smd: 1(-0.64,0.5) 2(-0.64,0) 3(-0.64,-0.5) 4(0.64,-0.5) 5(0.64,0) 6(0.64,0.5)

## Nets
As in the schematic, except:
2.5V: C5.2 C6.2 C7.2 C8.2 C9.2 C10.2 C11.2 C12.2 C13.2 C14.2 C15.2 C16.2 C17.2 C18.2 C19.2 C20.2 C21.2 C22.2 C23.2 C24.2 C45.2 C46.2 C47.2 C48.2 C49.2 C52.2 C53.2 L1.2 NOREF#4.1 NOREF#11.1 R5.1 R6.1 R8.1 R9.1 R10.1 R11.1 R12.1 R13.1 R14.1 R15.1 R16.1 R17.1 R18.1 R19.1 R20.1 R21.1 R22.1 R23.1 R24.1 R25.1 R26.1 R27.1 R28.1 R29.1 R30.1 R31.1 R32.1 R33.1 R34.1 R35.1 R36.1 R37.1 R38.1 R39.1 R40.1 R41.1 R42.1 R43.1 R44.1 R45.1 R46.1 R47.1 R49.2 R56.1 U4.1
GND: C5.1 C6.1 C7.1 C8.1 C9.1 C10.1 C11.1 C12.1 C13.1 C14.1 C15.1 C16.1 C17.1 C18.1 C19.1 C20.1 C21.1 C22.1 C23.1 C24.1 C45.1 C46.1 C47.1 C48.1 C49.1 C50.1 C51.1 C53.1 LED44.1 NOREF#3.1 NOREF#5.1 NOREF#6.1 NOREF#7.1 NOREF#9.1 NOREF#10.1 NOREF#12.1 NOREF#14.1 NOREF#15.1 NOREF#16.1 NOREF#17.1 NOREF#19.1 NOREF#20.5 NOREF#21.1 NOREF#22.1 Q1.1 R7.1 R51.1 R53.1 U4.8 U5.1 U5.6 V1.1
BAT+: C50.2 C51.2 NOREF#18.1 R52.2 U5.3 U5.4 U7.2
MOSFET: NOREF#13.1 Q1.2 R7.2 U4.5
RAW_BAT+: NOREF#8.5 U7.1
UPDI: NOREF.1 U4.6
$1N27880: NOREF#2.1 R55.2 U4.4

## Via types
v1: diameter 1.3, hole 0.7, Top Layer to Bottom Layer, 62 vias
v2: diameter 1.2, hole 0.7, Top Layer to Bottom Layer, 3 vias
v3: diameter 1, hole 0.5, Top Layer to Bottom Layer, 11 vias
v4: diameter 0.6, hole 0.3, Top Layer to Bottom Layer, 6 vias
v5: diameter 1, hole 0.7, Top Layer to Bottom Layer, 1 via
v6: diameter 0.8, hole 0.5, Top Layer to Bottom Layer, 2 vias
v7: diameter 0.7, hole 0.4, Top Layer to Bottom Layer, 2 vias

## Routing (per net, layer and track width the routed paths; a pad name or vN(x,y) marks a point on that pad's centre or on a via; arc(x,y) is an arc through that point)
2.5V: length 521.7
  Top Layer w0.3: 56.58,35.96 55.83,35.96 54.79,34.92 53.31,34.92 52.63,35.59 52.63,35.62
  Top Layer w0.4: 51.37,35.55 51.67,35.85 52.37,35.85 ; 50.58,35.6 51.26,35.6
  Top Layer w0.5: 4,24.84 4.05,24.79 v1(5.51,24.79) C6.2 7.1,24.84 8.95,24.84 ; v1(23.76,18.69) C24.2 24.12,21.93 23.24,21.93 22.42,22.75 22.42,26.04 23.17,26.79 R46.1
  Top Layer w0.6: C19.2 v1(39.28,35.09) R38.1 ; C23.2 R27.1 ; 68.03,23.27 66.44,23.27 66.34,23.37 64.78,23.37 v3(64.73,23.43) 63.19,23.43 R13.1 ; 19,4.52 19.4,6.12 ; C14.2 R37.1 ; v7(32.98,30.22) v7(33,28.05) ; 8.18,37.13 C45.2 v2(10.85,35.15) R6.1 ; R19.1 C9.2 ; 66.94,12.29 68.28,13.29 68.76,13.29 v1(69.64,14.17) 70.59,15.12 R42.1 ; R14.1 103.74,24.84 C12.2 103.64,24.84 v1(102.06,24.84) 100.52,24.84 R15.1 ; 59.86,19.62 62.37,19.62 63.23,18.75 63.23,14.27 61.92,12.96 53.94,12.96 53.22,13.69 53.22,13.98 ; R17.1 C22.2 40.54,13.33 v1(39.66,14.21) 38.7,15.16 38.4,15.16 ; 91.03,4.67 C8.2 90.46,7.65 v1(90.3,7.81) 89.64,8.47 89.64,8.97 ; R44.1 v1(98.36,35.07) C21.2 R45.1 ; 40.57,36.12 41.84,37.12 ; R10.1 45.98,25.04 C5.2 43.44,25.04 42.76,24.35 42.76,24.56 42.22,25.1 R11.1 ; 31.38,42.83 R30.1 ; C11.2 R23.1
  Top Layer w0.7: 31.38,42.83 v1(31.1,41.19) R31.1 ; 89.54,39.69 v1(90.23,41.12) 90.52,42.73 ; 11.69,15.18 11.36,15.18 v1(10.52,14.35) 9.63,13.46 9.25,13.46 9.11,13.31 7.78,12.33 ; C14.2 100.1,13.35 v1(99.03,14.42) 98.28,15.17 R36.1 ; 58.78,19.62 59.78,19.62 ; 83.28,26.83 arc(82.64,26.82) 82.04,26.62 arc(81.69,26.3) 81.52,25.87 arc(81.42,24.66) 81.46,23.44 arc(82.02,22.3) 83.21,21.83
  Top Layer w0.8: R33.1 78.53,4.86 78.53,5.81 v1(79.13,7.3) R32.1 ; C23.2 v1(70.19,35.23) R26.1 ; C15.2 v1(20.02,7.46) R28.1 ; R24.1 C10.2 v1(30.94,7.64) R25.1 ; R22.1 v1(20.1,41.56) C11.2 ; 83.35,21.77 83.36,19.85 82.67,19.14 82.15,17.86 ; v1(29.47,28.72) 29.26,28.72 v1(27.99,29.99) 23.43,29.99 v1(23.18,30.23) 21.09,28.14 v1(20.23,28.14) 20.23,26.09 v1(19.22,25.09) 19.73,24.58 v1(19.73,21.62) 20.82,21.62 v1(23.76,18.69) 24.33,19.26 v1(27.83,19.26) 28.91,20.34 v1(30.14,20.34) 30.14,22.27 31.57,23.69 v1(31.57,23.91) ; C9.2 v1(79.36,41.46) R18.1 ; 91.05,44.31 90.52,42.73
  Top Layer w1: 82.38,31.14 82.51,31.01 85.11,31.03 86.81,30.54 87.84,30.03 89.78,28.45 90.92,24.96 89.97,20.79 90.08,20.63 ; 78.62,28.69 78.22,27.44 77.68,26.1 77.48,24.83 77.53,23.74 ; 78.72,20.32 81.96,17.7 81.98,17.51 ; 90.06,20.57 89.34,20.61 86.58,18.13 86.57,17.89 ; 77.33,23.71 77.8,22.24 78.56,20.31 ; 79.06,28.6 82.31,30.72 82.39,31.11
  Bottom Layer w0.4: v7(32.98,30.22) 32.68,30.7
  Bottom Layer w0.5: 51.4,35.26 50.4,34.26 50.16,34.26 49.77,33.88 49.77,31.11 50.43,30.45 51.29,30.45 51.45,30.62 52.2,30.62 52.72,30.09 52.72,30.08 52.76,30.04 52.76,29.53 52.92,29.37 ; 32.96,27.93 33.6,27.56 arc(33.81,27.41) 34.07,27.36 52.54,27.36 arc(53.11,27.6) 53.35,28.17 53.35,28.58 arc(53.35,28.6) 53.35,28.63 arc(53.22,29.01) 52.92,29.29
  Bottom Layer w0.6: v1(10.52,14.35) v1(19.73,21.62)
  Bottom Layer w0.7: v1(31.1,41.19) v1(27.99,29.99) ; v1(20.1,41.56) v1(23.18,30.23)
  Bottom Layer w0.8: v1(30.14,20.34) v1(39.66,14.21) ; v1(5.51,24.79) v1(19.22,25.09) ; v2(10.85,35.15) v1(20.23,28.14) ; v1(30.94,7.64) v1(27.83,19.26) ; v1(23.76,18.69) v1(20.02,7.46)
  Bottom Layer w1: 46.87,15.01 46.89,13.44 48.32,13.46 ; 69.77,14.32 78.59,20.28 ; 89.88,28.56 98.35,35.09 ; v1(39.28,35.09) 31.54,29.98 v1(29.47,28.72) ; 79.34,41.51 82.37,31.12 ; 86.42,17.78 90.32,7.78 ; 90.25,41.14 86.35,30.74 ; 53.8,22.31 53.8,22.5 52.99,23.31 45.24,23.31 44.24,24.31 43.23,24.31 v1(42.76,23.83) ; 53.8,22.31 53.66,22.17 53.66,20.71 53.63,20.68 53.63,20.66 arc(53.56,20.27) 53.36,19.93 arc(52.98,19.66) 52.53,19.56 47.33,19.56 46.86,19.09 v1(46.86,14.98) ; 53.8,22.31 55,23.51 64.65,23.51 v3(64.73,23.43) 77.12,23.43 v1(77.34,23.65) ; 101.96,24.99 91.19,24.74 ; 79.34,7.38 82.02,17.61 ; 78.61,28.69 70.19,35.22 ; 98.9,14.42 90,20.58
  Bottom Layer w1.5: v1(42.76,23.83) 31.92,23.83
  vias: v1(48.29,13.47) v1(78.62,28.69) v1(78.58,20.26) v1(82.07,17.62) v1(82.36,31.13) v1(86.39,30.62) v1(86.42,17.81) v1(89.87,28.57) v1(90.06,20.57) v1(91.19,24.73)
GND: length 254.9
  Top Layer w0.3: 52.71,21.89 52.83,22.01 53.5,22.01 54.79,23.3 ; 53.85,35.91 54.13,35.91 v4(54.53,35.52)
  Top Layer w0.35: 51,18.93 50.89,18.93
  Top Layer w0.4: 53.46,20.28 53.44,20.28
  Top Layer w0.5: 52.32,33.58 51.8,33.58 v4(51.6,33.78) ; 61.57,31.38 60.89,30.7 60.89,30.39 ; 52.11,31.82 52.11,33.12 52.26,33.27 ; v1(5.52,23.33) 6.98,23.33 C6.1 ; 62.44,33.89 62.51,33.95 62.51,35.13 ; 50.47,29.9 50.47,30.06 50.46,30.08 50.46,31.19 50.77,31.5
  Top Layer w0.6: v1(40.09,33.88) 41.22,35.01 C19.1 ; 9.93,12.18 10.57,12.18 v1(11.41,13.03) ; v2(42.84,22.26) 44.1,22.26 44.38,22.54 C5.1 ; 69.1,12.15 69.71,12.15 v1(70.5,12.95) ; v1(98.04,13.18) 99,12.22 C14.1 ; v5(38.82,13.11) 39.74,12.19 40.16,12.19 ; v1(99.28,33.9) C21.1 ; v1(64.74,25.07) 65.03,24.77 C13.1 ; v1(88.87,7.34) 89.13,7.08 C8.1 ; C12.1 103.63,23.33 v1(102.04,23.33)
  Top Layer w0.7: v3(83.6,18.58) 84.73,19.71 C46.1 ; 53.46,20.28 53.88,20.7 55.54,20.7 56.53,19.72 56.78,19.72 56.82,19.67 ; v1(29.6,41.72) C16.1 ; v2(10.05,33.98) 8.7,35.03
  Top Layer w0.8: 47.26,18.83 47.3,18.88 49.4,18.88 ; 49.4,18.88 49.39,18.86 ; 49.4,18.88 50.89,18.93 ; C11.1 v1(18.59,41.05) ; v3(36.06,22.31) 36.05,22.91 33.9,25.09 31.57,25.61 29.71,24.72 27.16,21.94 C24.1 ; v1(77.66,7.77) 77.2,6.25 ; C10.1 v1(29.51,7.2) ; 69.34,34.07 67.96,34.99 ; 89.19,43.16 v1(88.74,41.58) ; 77.32,42.49 v1(77.9,40.95) ; v1(18.46,7.98) C15.1 ; 51,18.93 51,19.66 52.53,19.66 arc(53.09,19.83) 53.46,20.28 arc(53.49,20.38) 53.52,20.49 arc(53.53,20.57) 53.53,20.66 53.53,21.06 arc(53.45,21.46) 53.21,21.79 arc(53.04,21.92) 52.83,22.01 arc(52.68,22.05) 52.53,22.06 v6(51.85,22.06) 50.94,22.06 v6(50.81,22.07)
  Top Layer w1: 41.4,17.96 45.07,17.94 45.52,18.42 arc(46.04,18.67) 46.41,19.11 ; 62.26,35.39 62.26,35.38 60.69,35.38 ; 50.88,32.03 51.77,31.92
  Bottom Layer w0.6: v1(11.41,13.03) 21.42,20.9 NOREF#20.5 28.9,19.83 29.73,18.99 30.54,18.83 32.93,17.23 v5(38.82,13.11)
  Bottom Layer w0.7: v1(18.59,41.05) 22.18,28.74 NOREF#20.5 ; NOREF#20.5 v1(29.6,41.72) ; NOREF#20.5 18.71,27.54 v2(10.05,33.98)
  Bottom Layer w0.8: v2(42.84,22.26) 44.91,22.11 v6(50.81,22.07) 52.09,22.06 ; v1(29.51,7.2) NOREF#20.5 22.42,19.38 v1(18.46,7.98) ; v1(5.52,23.33) 19.29,23.43 22.37,23.98
  Bottom Layer w1: v2(42.84,22.26) 30.08,22.26 27.87,24.47
  Bottom Layer w2.2: NOREF#20.5 27.87,24.47
  vias: v1(52.88,18.26) v1(58.81,14.06) v1(60.69,35.35) v1(62.28,35.36) v1(69.29,34.02) v4(61.62,31.43)
ADC: length 26.2
  Top Layer w0.45: 49.31,30.37 49.31,30.8 49.74,31.23 49.74,32.71 50.39,33.36 v3(50.67,33.36)
  Top Layer w0.6: 62.39,32.33 62.34,32.28 60.79,32.28
  Bottom Layer w0.4: v4(61.62,32.49) 62.88,32.49 63.38,32.99 63.38,36.08 arc(63.35,36.21) 63.27,36.32 arc(63.16,36.39) 63.04,36.41 56.65,36.41 55.96,35.72 55.96,33.43 55.52,32.99 51.14,32.99 50.7,33.43
BAT+: length 27.9
  Top Layer w0.6: 60.89,33.69 60.88,33.7 58.32,33.7
  Top Layer w1: 57.73,34.07 55.32,31.27 55.33,30.1 55.29,29.77 arc(55.06,29.3) 54.94,28.79 arc(54.93,28.68) 54.93,28.56 54.93,28.16 arc(55.26,26.99) 56.16,26.18 56.24,25.96 56.22,25.09 56.2,21.8
  Bottom Layer w1: 61.69,18.21 61.69,18.07 ; 61.69,18.21 61.69,18.22 ; 61.69,18.21 61.69,18.23 ; 61.69,18.21 v1(61.69,16.49) ; 61.69,18.23 61.63,18.28 ; 61.69,18.23 61.68,18.75 arc(61.44,19.32) 60.86,19.56 57.13,19.56 arc(56.98,19.57) 56.82,19.6 arc(56.25,20) 56.03,20.66 56.03,21.06 arc(56.09,21.4) 56.25,21.72 56.2,21.8 ; 55.03,21.8 56.2,21.8
  vias: v3(55.03,21.8) v3(56.2,21.8)
MOSFET: length 12.4
  Top Layer w0.3: v3(51.82,29.71) 51.82,30.25 52.51,30.93 53.43,30.93 53.93,31.43 Q1.2
  Top Layer w0.5: 46.67,30.66 46.67,30.94 47.47,31.74 ; 53.82,33.36 53.83,33.35 53.83,32.05 53.82,32.04
  Bottom Layer w0.5: 47.47,31.74 47.47,30.33 48.21,29.59 51.89,29.59
RAW_BAT+: length 38.7
  Top Layer w1: 58.28,29.66 57.13,29.66 arc(56.35,29.34) 56.03,28.56 56.03,28.16 arc(56.35,27.38) 57.13,27.06 57.39,27.06 57.37,22.69 57.85,22.21
  Bottom Layer w1: 82.47,22.65 84.22,24.4 ; 82.47,22.65 83.33,21.79 ; 82.47,22.65 82,22.18 59.03,22.18 ; 82.47,22.65 82.47,22.66 ; 58.92,22.2 57.86,22.2
  vias: v3(57.86,22.21) v3(58.9,22.2)
SWITCH: length 439.2
  Top Layer w0.5: 11.19,25.76 11.09,25.87 1.77,25.87 1.67,25.76
  Top Layer w0.6: 64.47,11.62 67.25,13.84 70.94,16.52 72.25,17.27 ; 102.48,39.23 98.83,36.78 95.69,34.51 94.67,33.59 ; LED8.1 69.76,26.25 61.45,26.25 LED9.1 ; 14.57,33.62 12.54,35.29 8.34,38.34 6.82,39.26 ; 13.1,17.34 12.7,17.42 7.47,13.62 5.33,11.67 ; 44.79,11.68 43.62,12.71 39.52,15.69 37.03,17.32 ; LED17.1 91.66,7.76 92.78,4.3 92.83,2.75 ; 35.58,33.63 39.93,37 40.2,37.2 43.32,39.29 ; 107.68,25.84 107.44,26.09 98.44,26.09
  Top Layer w0.7: 96.31,17.55 98.72,16.25 102.79,13.3 104.13,11.87 ; 28.62,31.25 30.59,37.13 31.41,38.42 32.19,40.8 33.7,46.46 ; 81.42,37.86 80.67,41.42 79.57,44.8 78.4,47.23 ; 92.9,46.46 91.78,42.01 90.83,39.06 89.8,37.09 ; 24.23,31.66 22.26,38.12 21.86,40.22 21.48,41.37 19.13,47.33
  Top Layer w0.75: 53,29.75 52.99,29.42 arc(53.37,29.06) 53.51,28.56 53.51,28.16 arc(53.41,27.73) 53.12,27.39 arc(52.84,27.24) 52.53,27.18 51.53,27.18 50.79,25.44 51.11,24.65
  Top Layer w0.8: 91.89,26.11 97.73,26.11 ; 72.29,17.68 72.35,17.8 76.1,20.52 arc(76.41,21.47) 75.6,22.06 74.88,22.06 72.24,25.8 70.33,25.71 ; 72.29,25.81 75.35,25.84 76.34,25.96 76.86,27.81 76.74,31.31 74.01,33.65 ; 66.14,39.39 70,36.97 72.74,34.84 74.04,33.69 ; 36.92,17.8 32.63,20.54 30.16,18.87 28.66,17.99 ; 89.4,30.27 90.52,29.6 91.16,29.07 91.48,27.39 91.48,27.31 91.61,27 91.86,26.23 ; 18.14,20.85 18.22,20.94 17.69,26.05 ; 18.14,20.85 23.67,16.86 ; 18.14,20.85 13.1,17.34 ; 89.97,19.26 89.57,19.16 89.03,18.68 88.73,18.32 arc(88.72,18.31) 88.71,18.3 arc(88.51,18.03) 88.4,17.7 88.39,17.6 88.4,17.5 arc(88.41,17.45) 88.42,17.39 88.4,16.91 90.01,11.69 ; 17.69,26.05 11.19,25.76 ; 17.69,26.05 18.08,26.07 18.55,28.1 19.83,29.92 ; 83.31,32.64 83.47,32.62 ; 83.31,32.64 82.61,32.74 80.84,31.75 80.06,30.58 79.16,30.42 76.92,31.31 ; 83.31,32.64 81.48,37.78 ; 88.73,30.85 89.42,30.29 ; 88.73,30.85 88.51,30.91 88.01,31.23 87.39,31.55 87.15,31.68 85.6,32.12 85.12,32.16 84.5,32.16 84.25,32.23 arc(84.23,32.23) 84.21,32.24 arc(83.93,32.32) 83.69,32.48 83.46,32.6 ; 88.73,30.85 88.78,30.83 ; 88.73,30.85 88.05,31.39 87.95,31.69 89.82,37.05 ; 38.92,25.63 34.47,26.22 31.8,27.22 ; 31.8,27.22 28.19,25.69 LED42.1 ; 31.8,27.22 31.24,30.2 ; 91.49,21.09 91.05,19.71 90.18,19.23 ; 92.12,23.62 91.7,23.05 91.44,21.9 91.52,21.02 96.28,17.54 ; 19.83,29.92 20.56,29.75 22.58,31.62 24.23,31.66 28.62,31.25 29.53,30.35 31.24,30.2 ; 19.83,29.92 14.57,33.62 ; 28.66,17.99 30.59,11.67 ; 28.66,17.99 23.67,16.86 ; 23.67,16.86 23.4,16.8 21.57,8.29 21.13,6.92 19.13,1.86 ; 33.68,2.7 32.56,6.82 30.71,11.77 ; 84.58,17.27 85.99,19.89 85.99,23.53 85.91,25.16 85.34,24.44 ; 31.24,30.2 35.58,33.63 ; 81.3,10.97 81.9,11.76 83.37,16.27 arc(83.69,16.75) 84.21,16.98 arc(84.43,17) 84.65,16.98 arc(85.17,16.75) 85.5,16.27 85.53,16.18 88.39,17.05 ; 89.78,30.37 94.62,33.67 ; 92.24,23.68 92.46,24.94 91.99,25.83 ; 78.37,1.92 79.75,5.12 80.32,6.89 81.26,10.71
  Top Layer w1: v3(51.11,24.65) 50.68,25.61 48.53,25.64 47.56,26.6 39.89,26.6 38.92,25.63 ; LED9.1 59.15,25.65 v3(58.53,24.66)
  Bottom Layer w1: v3(58.53,24.66) v3(51.11,24.65)
UPDI: length 1.8
  Top Layer w0.4: 48.66,31.74 48.65,31.74 48.01,31.1 48.01,30.24
VIBRATION_SENSOR: length 22.3
  Top Layer w0.3: 57.8,35.78 57.8,35.66 57.33,35.19 55.91,35.19 55.22,34.5 51.16,34.5 50.89,34.24 49.41,34.24 49.17,34.48 49.13,34.52
  Top Layer w0.4: 63.08,30.57 63.38,30.86 63.38,36.08 arc(63.32,36.26) 63.18,36.38 arc(63.11,36.4) 63.04,36.41 58.39,36.41 58.09,36.11 ; 48.74,34.06 49.17,34.48 ; 49.19,34.52 49.19,35.54
  vias: v4(48.72,33.99)
$1N2397: length 2.4
  Top Layer w0.6: 5.61,37.59 7.3,35.91
$1N2467: length 2.4
  Top Layer w0.6: 13.35,31.95 R6.2
$1N2959: length 2.3
  Top Layer w0.5: 8.95,23.33 8.95,23.42 8.97,23.44 11.19,23.44
$1N2961: length 2.4
  Top Layer w0.5: 1.71,23.74 1.67,23.69 ; 4.08,23.48 1.71,23.48
$1N3108: length 2.5
  Top Layer w0.6: 48.53,23.57 48.5,23.59 R10.2
$1N3110: length 2.4
  Top Layer w0.6: R11.2 38.95,23.59 LED7.2
$1N3257: length 2.8
  Top Layer w0.6: R12.2 68.48,24.33 69.6,24.33 LED8.2
$1N3259: length 2.9
  Top Layer w0.6: LED9.2 61.69,24.42 62.48,24.42 62.98,24.92 R13.2
$1N3406: length 2.5
  Top Layer w0.6: R14.2 107.31,23.33 107.67,23.69
$1N3408: length 2.5
  Top Layer w0.6: R15.2 98.54,23.33 98.18,23.69
$1N4472: length 2.4
  Top Layer w0.6: R16.2 35.81,15.64
$1N4474: length 2.4
  Top Layer w0.6: R17.2 43.57,10
$1N4476: length 2.4
  Top Layer w0.6: R18.2 79.24,37.29
$1N4478: length 2.4
  Top Layer w0.6: R19.2 76.31,46.42
$1N4480: length 2.4
  Top Layer w0.6: 90.81,1.77 90.8,1.76 89.71,3.89 89.71,3.9
$1N4482: length 2.4
  Top Layer w0.6: 88.2,8.5 87.84,10.91
$1N4484: length 2.4
  Top Layer w0.6: 18.9,39.55 20.01,37.38
$1N4486: length 2.4
  Top Layer w0.6: 17.44,44.14 17.04,46.55
$1N4488: length 2.4
  Top Layer w0.6: 30.48,4.01 31.56,1.89
$1N4490: length 2.7
  Top Layer w0.8: 28.74,11.13 28.53,9.83 R25.2
$1N5215: length 2.4
  Top Layer w0.6: R26.2 72.61,31.91
$1N5217: length 2.4
  Top Layer w0.6: 66.57,35.87 64.84,37.54
$1N5219: length 2.4
  Top Layer w0.6: 20.03,11.52 R28.2
$1N5221: length 2.4
  Top Layer w0.6: 17.43,4.78 17.05,2.39
$1N5223: length 2.4
  Top Layer w0.6: 31.58,47.03 R30.2
$1N5225: length 2.5
  Top Layer w0.6: R31.2 28.58,37.91
$1N5227: length 2.5
  Top Layer w0.6: R32.2 79.17,11.4
$1N5229: length 2.9
  Top Layer w0.6: R33.2 76.22,4.45 76.22,2.26
$1N5231: length 2.4
  Top Layer w0.6: R34.2 90.72,46.91
$1N5233: length 2.4
  Top Layer w0.6: R35.2 87.74,37.81
$1N5958: length 2.3
  Top Layer w0.6: 96.72,13.95 95.05,15.6
$1N5960: length 2.4
  Top Layer w0.6: R37.2 102.82,9.95
$1N5962: length 2.5
  Top Layer w0.6: R38.2 36.79,31.95
$1N5964: length 2.5
  Top Layer w0.6: R39.2 44.54,37.62
$1N5966: length 2.4
  Top Layer w0.7: 8.67,11.11 6.55,9.99
$1N5968: length 2.4
  Top Layer w0.7: R41.2 14.31,15.66
$1N5970: length 2.5
  Top Layer w0.6: R42.2 73.46,15.59
$1N5972: length 2.4
  Top Layer w0.6: 67.82,11.07 65.69,9.94
$1N5974: length 2.4
  Top Layer w0.6: R44.2 95.89,31.91
$1N5976: length 2.4
  Top Layer w0.6: R45.2 103.7,37.55
$1N6160: length 3
  Top Layer w0.5: LED42.2 24.12,25.23 R46.2
$1N6162: length 2.9
  Top Layer w0.8: R47.2 LED43.2
$1N26861: length 1.5
  Top Layer w0.3: 54.69,19.02 54.69,19.74 54.87,19.92 55.11,19.92 55.28,19.75 55.28,19.74
$1N27838: length 2.3
  Top Layer w0.25: R55.1 53.19,23.72 LED44.2
$1N27880: length 24.4
  Top Layer w0.25: R55.2 53.08,25.32 53.08,25.89 54.12,26.93 54.12,29.85 54.58,30.31 54.58,32.04 54.95,32.41 54.95,33.62 v4(55.11,33.78)
  Top Layer w0.4: 46.65,35.53 46.65,34 46.55,33.9 ; 46.74,35.39 46.74,35.39
  Bottom Layer w0.3: v4(55.11,33.78) 55.41,34.08 55.41,35.88 54.83,36.46 47.15,36.46 46.66,35.97 46.66,34.06

## Copper pours and planes (outline as drawn; the poured copper is in the pictures)
2.5V on Top Layer: 54.12,12.62 54.12,15.75 52,17.87 46.38,17.87 46.14,17.62 46.14,12.89 46.44,12.59 48.92,12.59 50.28,12.59 51.05,12.58
GND on Top Layer: 50.36,22.63 56.59,22.63 57.39,21.82 57.39,19.17 53.6,19.17 50.36,22.41
GND on Top Layer: 57.07,15.7 57.07,14.08 57.62,13.54 61.69,13.54 62.34,14.19 62.34,15.15 61.86,15.63 57.15,15.63
GND on Top Layer: 54.32,16.49 54.29,16.45 53.88,16.45 52.33,18.01 46.13,18.01 45.96,18.17 45.96,19.76 46.23,20.03 53.88,20.03 54.21,19.69 54.34,19.57
GND on Bottom Layer: -16.62,57.32 119.35,57.32 119.35,-22.1 -16.62,-22.1
BAT+ on Top Layer: 55.03,22.3 56.21,22.3 56.65,22.16 56.7,21.81 56.57,21.48 56.23,21.3 55,21.3 54.72,21.42 54.59,21.96 54.82,22.23
BAT+ on Top Layer: 55.05,19.32 55.05,16.76 55.56,16.25 56.5,16.25 56.92,15.83 62.48,15.8 62.5,18.5 62,18.99 61.41,18.99 60.35,17.07 56.23,17.09 55.52,17.8 55.52,18.84
BAT+ on Top Layer: 56.01,34.64 59.46,34.64 59.46,31.38 56.01,31.38
RAW_BAT+ on Top Layer: 57.84,22.71 58.92,22.7 59.39,22.22 58.92,21.69 57.84,21.71 57.75,21.72 57.68,21.74 57.62,21.77 57.45,21.91
SWITCH on Top Layer: -3.07,54.08 -0.46,51.47 -0.46,-3.63 102.04,-3.63 111.43,5.76 111.43,40.86 103.17,49.12 97.15,49.12 94.55,51.72 71.29,51.72 61.38,41.81 62.41,40.77 62.41,37.52 62.81,37.12 63.01,37.12 63.48,36.94 64.56,36.02 64.42,28.61 57.15,28.18 52.03,28.24 45.18,28.47 45.65,36.48 46.4,37.11 47.22,37.6 46.83,51.5
$1N26713 on Top Layer: 56.98,16.18 56.98,13.46 55.31,13.46 54.51,14.25 54.49,18.12 54.88,18.12 54.89,17.21 55.92,16.18
$1N26861 on Top Layer: 54.53,18.66 54.83,18.66 54.83,19.56 55.42,19.56 55.69,19.3 55.69,18.15 56.54,17.3 60.2,17.3 60.66,17.94 60.66,18.98 60.56,19.06 56.4,19.04 55.34,20.14 54.53,20.14

## Text on the board
Bottom Silkscreen Layer: bukajlag | Gazi | robofuze.com | K | MrShu | - | +
Top Silkscreen Layer: BAT+ | GND | robofuze.com | 2.5V | junior.robocup.org
